# EAGLE schematic antenna-tuner (EAGLE 9.2.2)
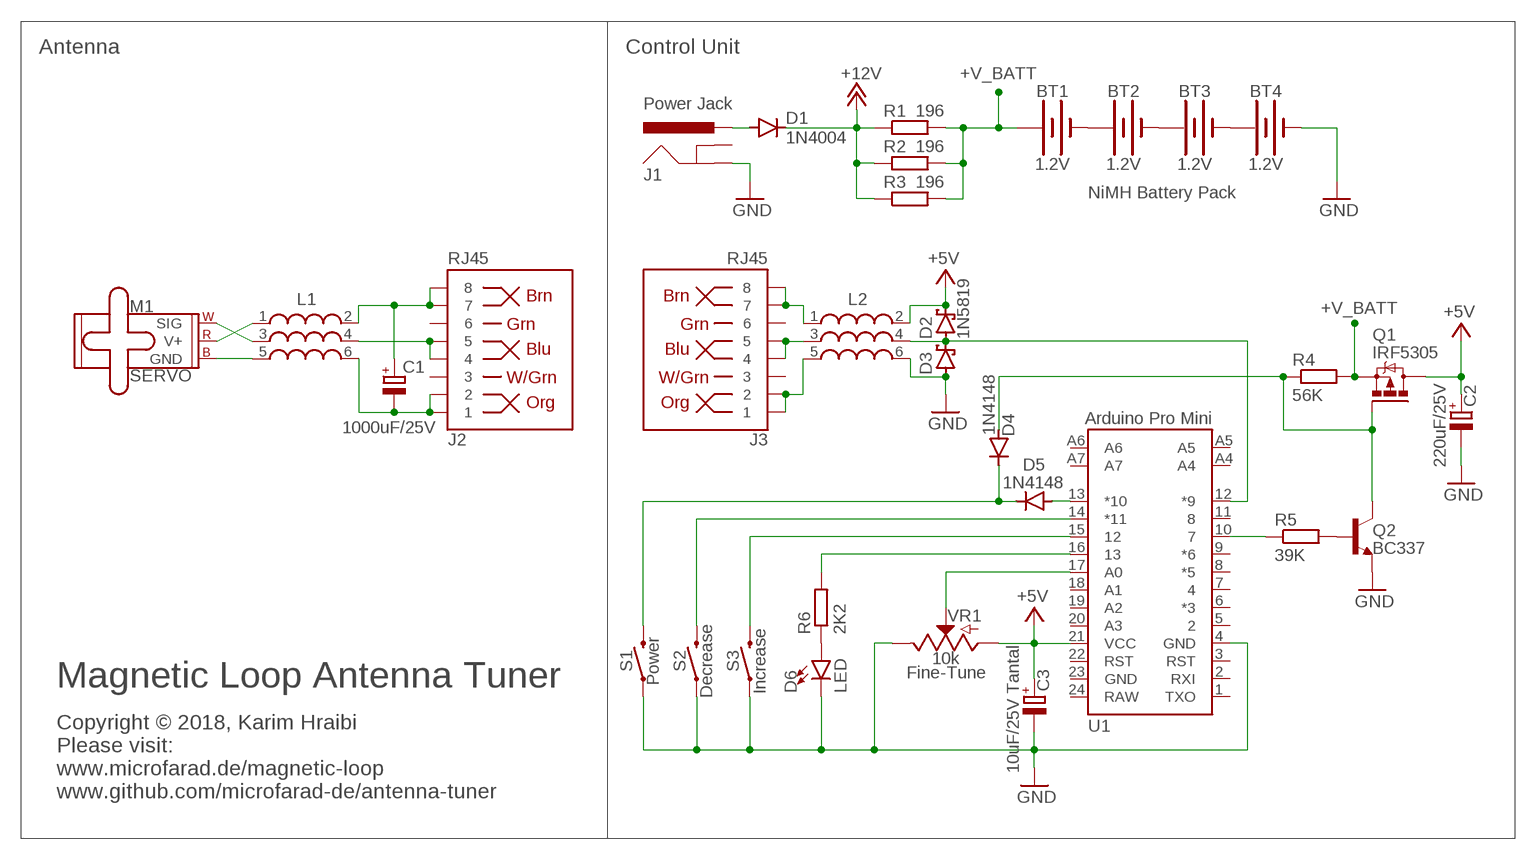
[diagram p0: schematic, sheet 1]

## Parts
BT1  1.2V  BATTERY-AA  [BATTERY-AA]
BT2  1.2V  BATTERY-AA  [BATTERY-AA]
BT3  1.2V  BATTERY-AA  [BATTERY-AA]
BT4  1.2V  BATTERY-AA  [BATTERY-AA]
C1  1000uF/25V  CPOL-EUE5-10.5  [E5-10,5]
C2  220uF/25V  CPOL-EUE2.5-6  [E2,5-6]
C3  10uF/25V Tantal  CPOL-EUE2.5-6  [E2,5-6]
D1  1N4004  [DO41-10]
D2  1N5819  1N5819-B  [DO41-7.6]
D3  1N5819  1N5819-B  [DO41-7.6]
D4  1N4148  1N4148DO35-7  [DO35-7]
D5  1N4148  1N4148DO35-7  [DO35-7]
D6  LED  LED5MM  [LED_5MM]
J1  Power Jack  POWER_JACKPTH_BREAD  [POWER_JACK_PTH_BREAD]
J2  RJ45  RJ45-8  [RJ45-8]
J3  RJ45  RJ45-8  [RJ45-8]
L1  WE-MLS-3WAY_74273001  [WE-3WAY_74273001]
L2  WE-MLS-3WAY_74273001  [WE-3WAY_74273001]
M1  SERVO  [1X03]
Q1  IRF5305  [TO220V]
Q2  BC337  [TO92]
R1  196  R-EU_0207/7  [0207/7]
R2  196  R-EU_0207/7  [0207/7]
R3  196  R-EU_0207/7  [0207/7]
R4  56K  R-EU_0207/7  [0207/7]
R5  39K  R-EU_0207/7  [0207/7]
R6  2K2  R-EU_0207/7  [0207/7]
S1  Power  MOMENTARY-SWITCH-SPST-PTH-6.0MM  [TACTILE_SWITCH_PTH_6.0MM]
S2  Decrease  MOMENTARY-SWITCH-SPST-PTH-6.0MM  [TACTILE_SWITCH_PTH_6.0MM]
S3  Increase  MOMENTARY-SWITCH-SPST-PTH-6.0MM  [TACTILE_SWITCH_PTH_6.0MM]
U1  Arduino Pro Mini  ARDUINO_PRO_MINI_TS  [ARDUINO_PRO_MINI_TS]
VR1  10k  POTENTIOMETER-PTH-9MM-1/20W-20%  [POT-PTH-ALPS]

## Nets
+5V: C2.+ C3.+ D2.C L2.2 Q1.2(D$1) U1.21(VCC) VR1.P$3(A)
+12V: D1.C R1.1 R2.1 R3.1
+V_BATT: BT1.PWR@1(+) Q1.3(S$1) R1.2 R2.2 R3.2 R4.2
GND: BT4.GND@1(-) C2.- C3.- D3.A D6.K(C) J1.GND L2.6 Q2.1(E) S1.1 S2.1 S3.1 U1.4(GND) VR1.P$1(E)
N$1: D1.A J1.PWR
N$2: BT1.GND@1(-) BT2.PWR@1(+)
N$3: BT3.GND@1(-) BT4.PWR@1(+)
N$4: BT2.GND@1(-) BT3.PWR@1(+)
N$5: U1.17(A0) VR1.P$2(S)
N$6: Q2.2(B) R5.1 R5.2 U1.10
N$7: D6.A R6.1
N$8: D4.A Q1.1(G$1) Q2.3(C) R4.1
N$9: R6.2 U1.16
N$10: S3.3 U1.15
N$11: S2.3 U1.14(*11)
N$12: D5.A U1.13(*10)
N$13: D4.C D5.C S1.3
N$14: D2.A D3.C L2.4 U1.12(*9)
N$15: J3.1 J3.2 L2.5
N$16: J3.7 J3.8 L2.1
N$17: J3.4 J3.5 L2.3
N$18: C1.+ J2.7 J2.8 L1.2
N$19: J2.4 J2.5 L1.4
N$20: C1.- J2.1 J2.2 L1.6
N$21: L1.1 M1.2(V+)
N$22: L1.5 M1.3(GND)
N$23: L1.3 M1.1(SIG)
Unconnected: J1.GNDBREAK J2.3 J2.6 J3.3 J3.6 U1.1(TXO) U1.2(RXI) U1.3(RST) U1.5 U1.6(*3) U1.7 U1.8(*5) U1.9(*6) U1.11 U1.18(A1) U1.19(A2) U1.20(A3) U1.22(RST) U1.A4 U1.A5 U1.A6 U1.A7

## Notes on the sheet
- Antenna | Control Unit
- NiMH Battery Pack
- Magnetic Loop Antenna Tuner
- Fine-Tune
- Copyright © 2018, Karim Hraibi
  Please visit:
  www.microfarad.de/magnetic-loop
  www.github.com/microfarad-de/antenna-tuner

## Power pins joined to a net without a drawn wire
GND: U1.23(GND)
RAW: U1.24(RAW)

## Library data of the parts
BT1-BT4 = SparkFun-Batteries:BATTERY: Battery - Single Cell A variety of battery chemistries, sizes, and footprints. Device List: 20MM_PTH - Coin Cell Battery Holder - 20mm (PTH) <https://www.sparkfun.com/products/783> 6.8MM_PTH - Coin Cell Battery Holder - 6.8MM(SMD) <https://www.digikey.com/product-detail/en/seiko-instruments/MS621FE-FL11E/728-1057-ND/1889208?WT.srch=1&gclid=CNOQ5a6LzdQCFZS2wAodXCkE0g> 12MM_SMD - Coin Cell Battery Holder - 12mm (SMD) <https://www.sparkfun.com/products/10592> 12MM_PTH - Coin Cell Battery Holder - 12mm (PTH) <https://www.sparkfun.com/products/7948> 20MM_SMD - 20mm Coin Cell Battery Holder (SMD) (2 legs) Used on the Big Time Watch Kit <https://www.sparkfun.com/products/11734> 20MM_SMD_4LEGS - Coin Cell Battery Holder - 20mm (SMD) <https://www.sparkfun.com/products/11892> 20MM_SMD_4LEGS_OVERPASTE - Coin Cell Battery Holder - 20mm (SMD) <https://www.sparkfun.com/products/11892> (Over-paste on the legs) 24.5MM_PTH - Coin Cell Battery Holder - 24.5mm (PTH) <https://www.sparkfun.com/products/8863> 9V - 9V Battery Holder - PC Mount Used on the SparkFun SparkPunk Sound Kit <https://www.sparkfun.com/products/11177> and SparkFun SparkPunk Sequencer Kit <https://www.sparkfun.com/products/12707> 18650 - Battery Holder - 18650 (PTH) <https://www.sparkfun.com/products/13113> AA - Battery Holder - 1xAA (PTH) <https://www.sparkfun.com/products/7949> AAA - Battery Holder - 1xAAA (PTH) <https://www.sparkfun.com/products/12718> AA_KIT - Battery Holder - 1xAA (PTH) <https://www.sparkfun.com/products/7949> Special kit package - pads only have exposed copper on one side of the board. AAA_KIT - Battery Holder - 1xAAA (PTH) <https://www.sparkfun.com/products/12718> Special kit package - pads only have exposed copper on one side of the board.; PROD_ID: BATT-08316; SF_SKU: PRT-07949
C1-C3 = rcl:CPOL-EU: POLARIZED CAPACITOR, European symbol; SPICEPREFIX: C
D1 = diode:1N4004: DIODE general purpose rectifier, 1 A
D2 D3 = diode:1N581*: 1.0A SCHOTTKY BARRIER RECTIFIER Source: http://www.diodes.com/datasheets/ds23001.pdf
D4 D5 = diode:1N4148: DIODE high speed (Philips)
D6 = SparkFun-LED:LED: LED (Generic) Standard schematic elements and footprints for 5mm, 3mm, 1206, and 0603 sized LEDs. Generic LEDs with no color specified.
J1 = SparkFun-Connectors:POWER_JACK: Power Jack Connector This is the standard 5.5mm barrel jack for power. The PTH is the most common, proven, reliable, footprint. The Slot footprint only works if the mill layer is transmitted to the PCB fab house so be warned. Here are the connectors we sell at SparkFun: DC Barrel Power Jack/Connector <https://www.sparkfun.com/products/119> (PRT-00119) DC Barrel Power Jack/Connector (SMD) <https://www.sparkfun.com/products/12748> (PRT-12748) DC Barrel Jack Adapter - Breadboard Compatible <https://www.sparkfun.com/products/10811> (PRT-10811) It is used on this SparkFun product (and many, many others): SparkFun RedBoard - Programmed with Arduino <https://www.sparkfun.com/products/12757> (DEV-12757) Also, if you need a mating power supply or connector, please check these out: Wall Adapter Power Supply - 9VDC 650mA <https://www.sparkfun.com/products/298> (TOL-00298) DC Barrel Jack Adapter - Male <https://www.sparkfun.com/products/10287> (PRT-10287); PROD_ID: PRT-10811
J2 J3 = SparkFun-Connectors:RJ45-8: RJ45 Jack - 8 pin Simple RJ45, 8-pin connection. Commonly used for Cat5, Cat5e, and Cat6 Ethernet cables. Here is the connector we sell at SparkFun: RJ45 8-Pin Connector <https://www.sparkfun.com/products/643> (PRT-00643) Datasheet <https://cdn.sparkfun.com/datasheets/Prototyping/04908.pdf> It is used on this SparkFun product: SparkFun RJ45 Breakout <https://www.sparkfun.com/products/716> (BOB-00716) Note, you may also be interested in the "MAGJACK" version of this. It is basically a RJ45 connector, but also has some status LEDs built into the connector housing. You can check that out in this library at the device named "MAGJACK.dev" and see these products online: RJ45 Ethernet MagJack-Compatible <https://www.sparkfun.com/products/8534> (PRT-08534) SparkFun RJ45 MagJack Breakout <https://www.sparkfun.com/products/13021> (BOB-13021); PROD_ID: CONN-08506; SF_ID: PRT-00643
L1 L2 = Wurth_Elektronik_Passive_rev18f:WE-MLS-3WAY: Multiline EMI Suppression Ferrite Characteristics High impedance common mode inductor with 2x2 windings made by PCB line connection High rated current with typ. 4 A Broadband filtering because of the NiZn-ferrite core RF common mode inductor for 2, 3 or 4 lines in one component Compact size Operating temperature: –25 ºC to +125 ºC Custom designs on request With the appropriate layout (see below) the impedance (i.e. 4 windings) respectively the current (parallel circuit) could be increased Applications Perfect suitable for absorption of common or differential mode interferences in the field of EMC High-current DC output filters of power supplies e.g. battery chargers, industrial power supplies With one turn the component performes like a 3 or 4 times common mode choke for the signal 4-line sensor application <http://katalog.we-online.de/media/images/v2/Family_WE-MLS.jpg> Details see: http://katalog.we-online.de/en/pbs/WE-MLS? Updated by Dan Xu 2014-07-08 2014 (C) Wurth Elektronik
M1 = SparkFun-Electromechanical:SERVO: Servo Motor 3-pin connector for a standard servo motor (voltage supply, ground, and control signal.) SparkFun Products Servo - Generic (Sub-Micro Size) <https://www.sparkfun.com/products/9065> (ROB-09065) Servo - Generic High Torque Continuous Rotation (Standard Size) <https://www.sparkfun.com/products/9347> (ROB-09347) Servo - Generic High Torque (Standard Size) <https://www.sparkfun.com/products/11965> (ROB-11965)
Q1 = microfarad-de:IRF5305: IRF5305 HEXFET® Power MOSFET P-Channel MOSFET: VDSS = -55V RDS(on) = 0.06Ω ID = -31A
Q2 = transistor-npn:BC337*: NPN Transistor
R1-R6 = rcl:R-EU_: RESISTOR, European symbol; SPICEPREFIX: R
S1-S3 = SparkFun-Switches:MOMENTARY-SWITCH-SPST: Momentary Switch (Pushbutton) - SPST Normally-open (NO) SPST momentary switches (buttons, pushbuttons). Variants PTH-12MM - 12mm square, through-hole Momentary Pushbutton Switch - 12mm Square <https://www.sparkfun.com/products/9190> (COM-09190) PTH-6.0MM, PTH-6.0MM-KIT - 6.0mm square, through-hole Mini Pushbutton Switch <https://www.sparkfun.com/products/97> (COM-00097) KIT package intended for soldering kit's - only one side of pads' copper is exposed. PTH-RIGHT-ANGLE-KIT - Right-angle, through-hole Right Angle Tactile Button <https://www.sparkfun.com/products/10791> - Used on SparkFun BigTime Watch Kit <https://www.sparkfun.com/products/11734> SMD-12MM - 12mm square, surface-mount Tactile Button - SMD (12mm) <https://www.sparkfun.com/products/12993> (COM-12993) Used on SparkFun PicoBoard <https://www.sparkfun.com/products/11888> SMD-4.5MM - 4.5mm Square Trackball Switch Used on SparkFun Blackberry Trackballer Breakout <https://www.sparkfun.com/products/13169> SMD-4.6MMX2.8MM - 4.60mm x 2.80mm, surface mount Used on SparkFun SAMD21 Mini Breakout <https://www.sparkfun.com/products/13664> SMD-5.2MM, SMD-5.2-REDUNDANT - 5.2mm square, surface-mount Mini Pushbutton Switch - SMD <https://www.sparkfun.com/products/8720> (COM-08720) Used on Arduino Pro Mini <https://www.sparkfun.com/products/11114> REDUNDANT package connects both switch circuits together SMD-6.0X3.5MM - 6.0 x 3.5mm, surface mount Momentary Reset Switch SMD <https://www.sparkfun.com/products/8229> (COM-08229) SMD-6.2MM-TALL - 6.2mm square, surface mount Tactile Button - SMD (6mm) <https://www.sparkfun.com/products/12992> Used on SparkFun Digital Sandbox <https://www.sparkfun.com/products/12651> SMD-RIGHT-ANGLE - Right-angle, surface mount Used on SparkFun Block for Intel® Edison - Arduino <https://www.sparkfun.com/products/13036>; PROD_ID: SWCH-08441; SF_SKU: COM-00097
U1 = microfarad-de:ARDUINO_PRO_MINI: Arduino Pro Mini Arduino Pro Mini compatible devices. Variants: Original "The Simple" clone (TS)
VR1 = SparkFun-Resistors:POTENTIOMETER: Potentiometer (Pot) Three-terminal potentiometers, with an adjustable wiper and two adjustable resistors. A pot can be used to create a configurable voltage divider, or as a variable resistor. Variants ALPS_POT and ALPS_POT_KIT - PTH, breadboard compatible, 9mm square pots Rotary Potentiometer - Linear (10k ohm) <https://www.sparkfun.com/products/9288> (COM-09288) The KIT variant exposes copper on only one side of the PTH pad, so the part can only be assembled on one side of the PCB. Useful for beginner soldering kits.; PROD_ID: RES-09177; SF_SKU: COM-09288